# EAGLE design ac_meter_rev02 (EAGLE 5.11)
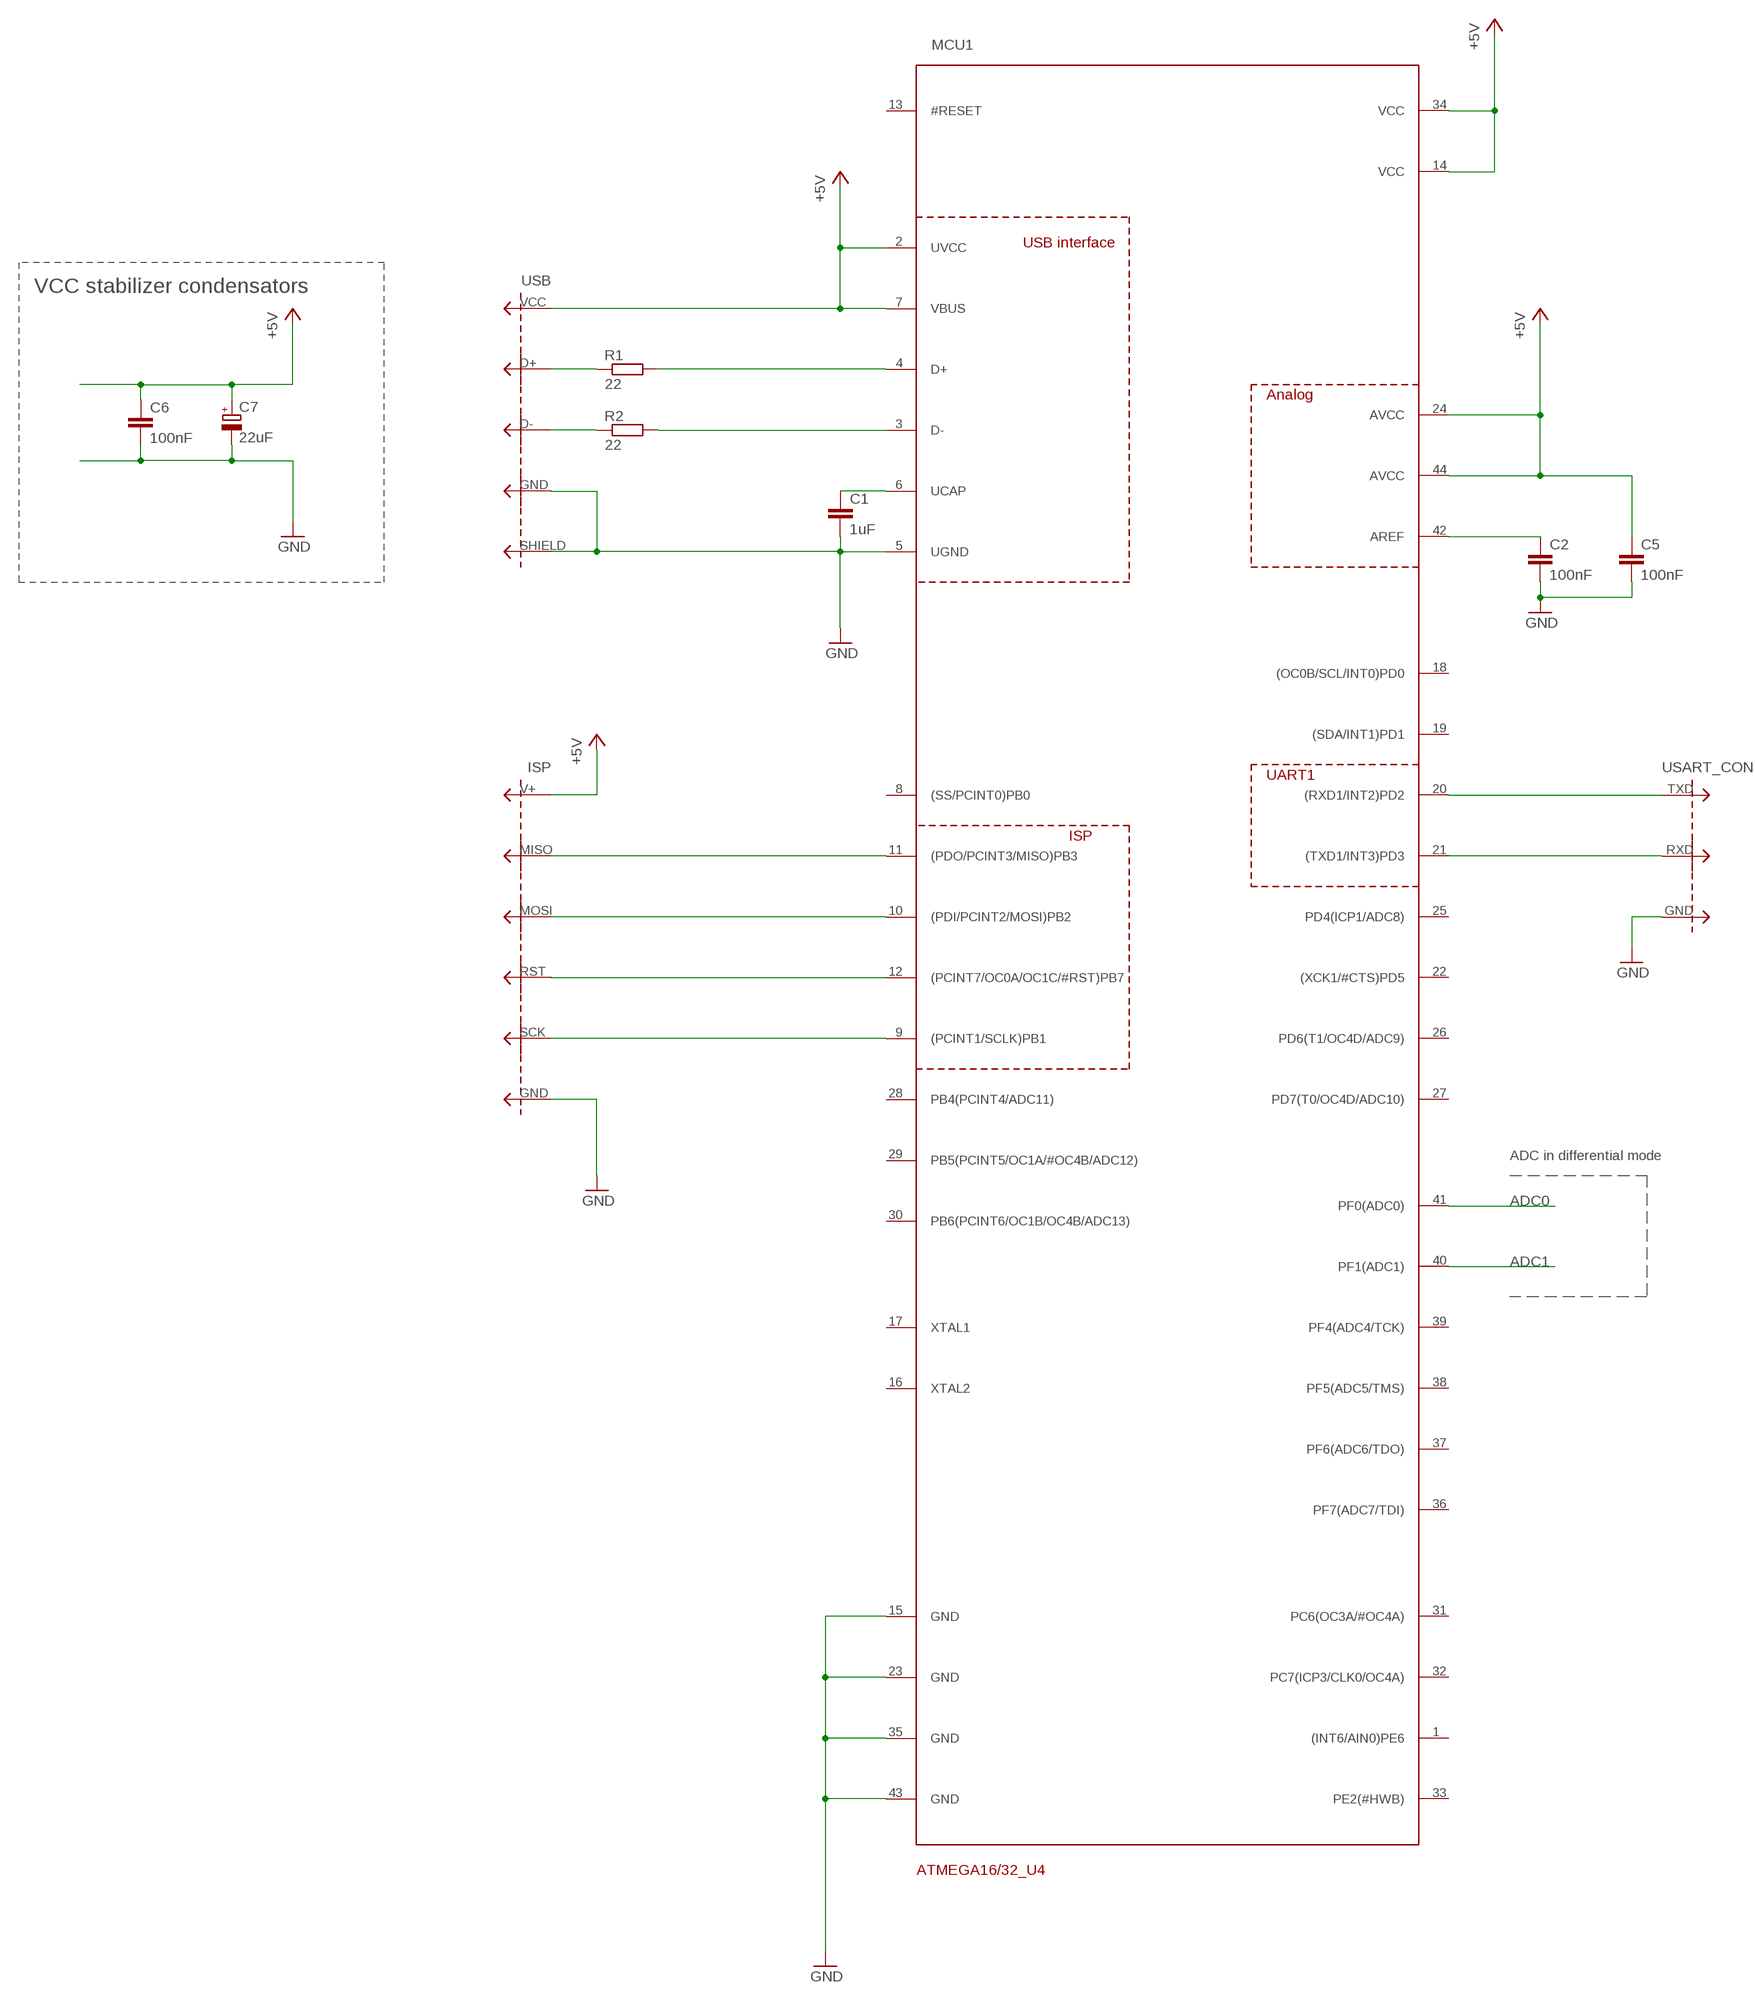
[diagram p0: schematic, sheet 1, part 1 of 2]
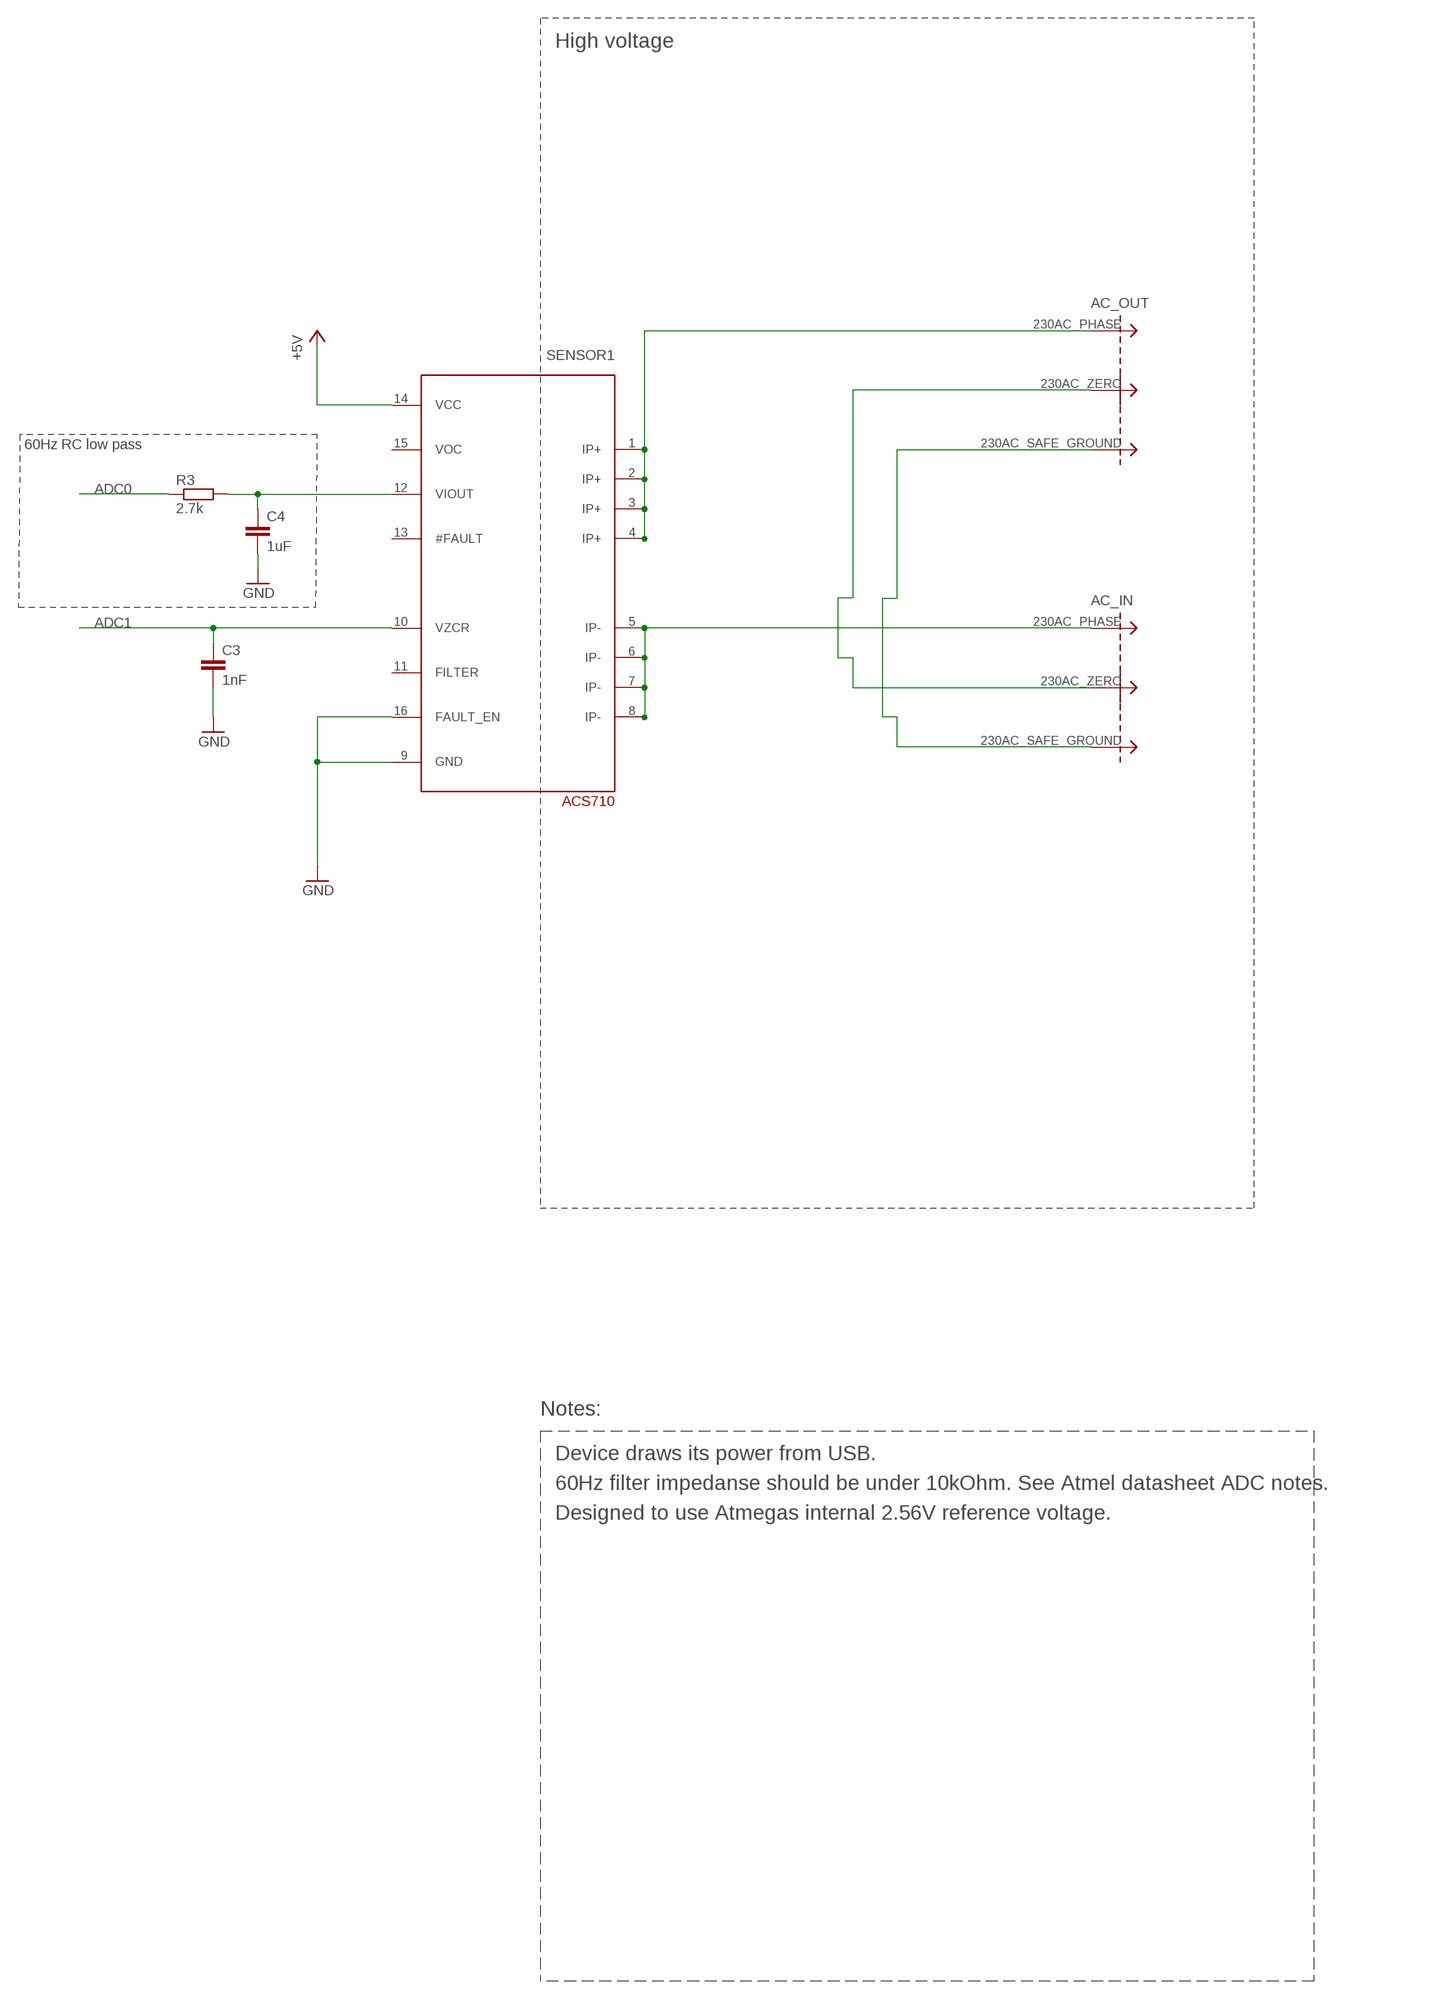
[diagram p1: schematic, sheet 1, part 2 of 2]

## Parts
AC_IN  CONNECTOR_3PINMAINS_SOLDER_PADS  [1X3_MAINS_SOLDER_PADS]
AC_OUT  CONNECTOR_3PINMAINS_SOLDER_PADS  [1X3_MAINS_SOLDER_PADS]
C1  1uF  C-EUC1206  [C1206]
C2  100nF  C-EUC1206  [C1206]
C3  1nF  C-EUC1206  [C1206]
C4  1uF  C-EUC1206  [C1206]
C5  100nF  C-EUC1206  [C1206]
C6  100nF  C-EUC1206  [C1206]
C7  22uF  CPOL-EUE2.5-6  [E2,5-6]
ISP  CONNECTOR_6PIN2X3_ISP  [2X3_ISP]
MCU1  ATMEGA16/32_U4  [TQFP44]
R1  22  R-EU_0207/10  [0207/10]
R2  22  R-EU_0207/10  [0207/10]
R3  2.7k  R-EU_0207/10  [0207/10]
SENSOR1  ACS710_CURRENT_SENSOR  [SO-16W]
USART_CON  CONNECTOR_3PINUSART  [1X3_USART]
USB  CONNECTOR_5PINUSB_SMD  [1X5_USB]

## Nets
+5V: C5.1 C6.1 C7.+ ISP.V+ MCU1.2(UVCC) MCU1.7(VBUS) MCU1.14(VCC) MCU1.24(AVCC) MCU1.34(VCC) MCU1.44(AVCC) SENSOR1.14(VCC) USB.VCC
ADC0: MCU1.41(PF0(ADC0)) R3.1
ADC1: C3.1 MCU1.40(PF1(ADC1)) SENSOR1.10(VZCR)
GND: C1.2 C2.2 C3.2 C4.2 C5.2 C6.2 C7.- ISP.GND MCU1.5(UGND) MCU1.15(GND) MCU1.23(GND) MCU1.35(GND) MCU1.43(GND) SENSOR1.9(GND) SENSOR1.16(FAULT_EN) USART_CON.GND USB.GND USB.SHIELD
N$1: ISP.MISO MCU1.11((PDO/PCINT3/MISO)PB3)
N$2: ISP.MOSI MCU1.10((PDI/PCINT2/MOSI)PB2)
N$3: ISP.RST MCU1.12((PCINT7/OC0A/OC1C/#RST)PB7)
N$4: ISP.SCK MCU1.9((PCINT1/SCLK)PB1)
N$5: R1.1 USB.D+
N$6: R2.1 USB.D-
N$7: MCU1.3(D-) R2.2
N$8: MCU1.4(D+) R1.2
N$9: C1.1 MCU1.6(UCAP)
N$10: C4.1 R3.2 SENSOR1.12(VIOUT)
N$11: C2.1 MCU1.42(AREF)
N$12: MCU1.20((RXD1/INT2)PD2) USART_CON.TXD
N$13: MCU1.21((TXD1/INT3)PD3) USART_CON.RXD
PHASE_IN: AC_IN.230AC_PHASE SENSOR1.5(IP-) SENSOR1.6(IP-) SENSOR1.7(IP-) SENSOR1.8(IP-)
PHASE_OUT: AC_OUT.230AC_PHASE SENSOR1.1(IP+) SENSOR1.2(IP+) SENSOR1.3(IP+) SENSOR1.4(IP+)
SAFE_GROUND: AC_IN.230AC_SAFE_GROUND AC_OUT.230AC_SAFE_GROUND
ZERO: AC_IN.230AC_ZERO AC_OUT.230AC_ZERO
Unconnected: MCU1.1((INT6/AIN0)PE6) MCU1.8((SS/PCINT0)PB0) MCU1.13(#RESET) MCU1.16(XTAL2) MCU1.17(XTAL1) MCU1.18((OC0B/SCL/INT0)PD0) MCU1.19((SDA/INT1)PD1) MCU1.22((XCK1/#CTS)PD5) MCU1.25(PD4(ICP1/ADC8)) MCU1.26(PD6(T1/OC4D/ADC9)) MCU1.27(PD7(T0/OC4D/ADC10)) MCU1.28(PB4(PCINT4/ADC11)) MCU1.29(PB5(PCINT5/OC1A/#OC4B/ADC12)) MCU1.30(PB6(PCINT6/OC1B/OC4B/ADC13)) MCU1.31(PC6(OC3A/#OC4A)) MCU1.32(PC7(ICP3/CLK0/OC4A)) MCU1.33(PE2(#HWB)) MCU1.36(PF7(ADC7/TDI)) MCU1.37(PF6(ADC6/TDO)) MCU1.38(PF5(ADC5/TMS)) MCU1.39(PF4(ADC4/TCK)) SENSOR1.11(FILTER) SENSOR1.13(#FAULT) SENSOR1.15(VOC)

## Notes on the sheet
- High voltage
- 60Hz RC low pass
- VCC stabilizer condensators
- Notes:
- ADC in differential mode
- Device draws its power from USB.
- 60Hz filter impedanse should be under 10kOhm. See Atmel datasheet ADC notes.
- Designed to use Atmegas internal 2.56V reference voltage.

## Library data of the parts
AC_IN AC_OUT USART_CON = connectors:CONNECTOR_3PIN
C1-C6 = RC_and_L:C-EU: CAPACITOR, European symbol
C7 = RC_and_L:CPOL-EU: POLARIZED CAPACITOR, European symbol
ISP = connectors:CONNECTOR_6PIN
MCU1 = project_specific_parts:ATMEGA16/32_U4
R1-R3 = RC_and_L:R-EU_: RESISTOR, European symbol
SENSOR1 = project_specific_parts:ACS710_CURRENT_SENSOR
USB = connectors:CONNECTOR_5PIN

## Board
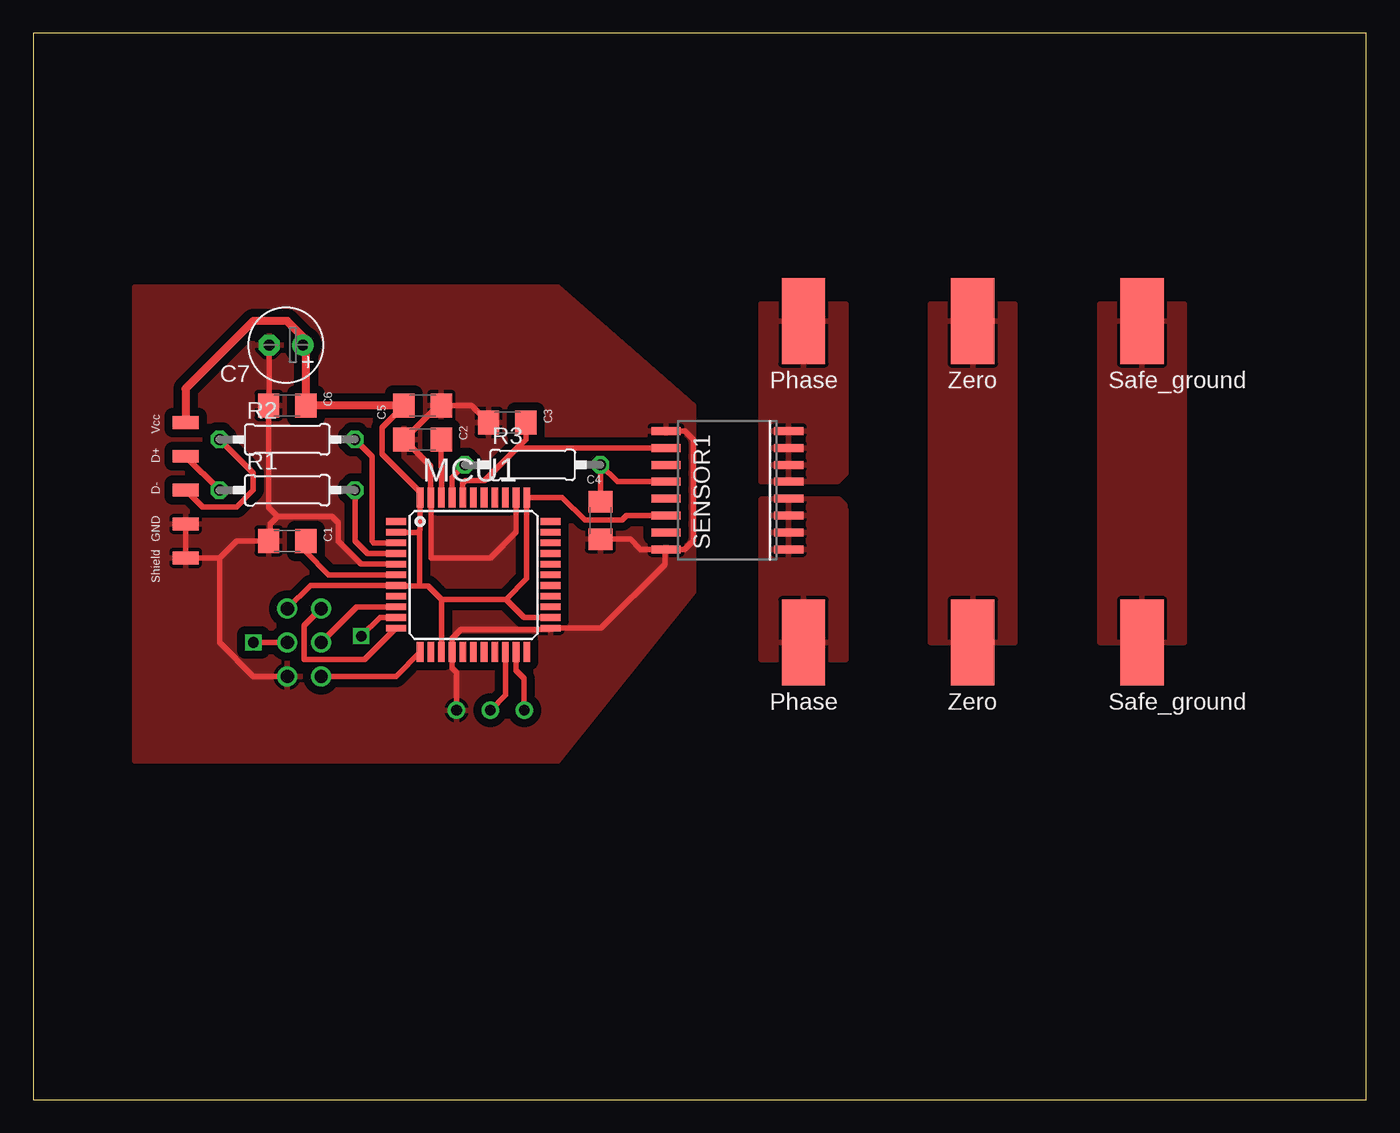
[diagram p2: board, top side]
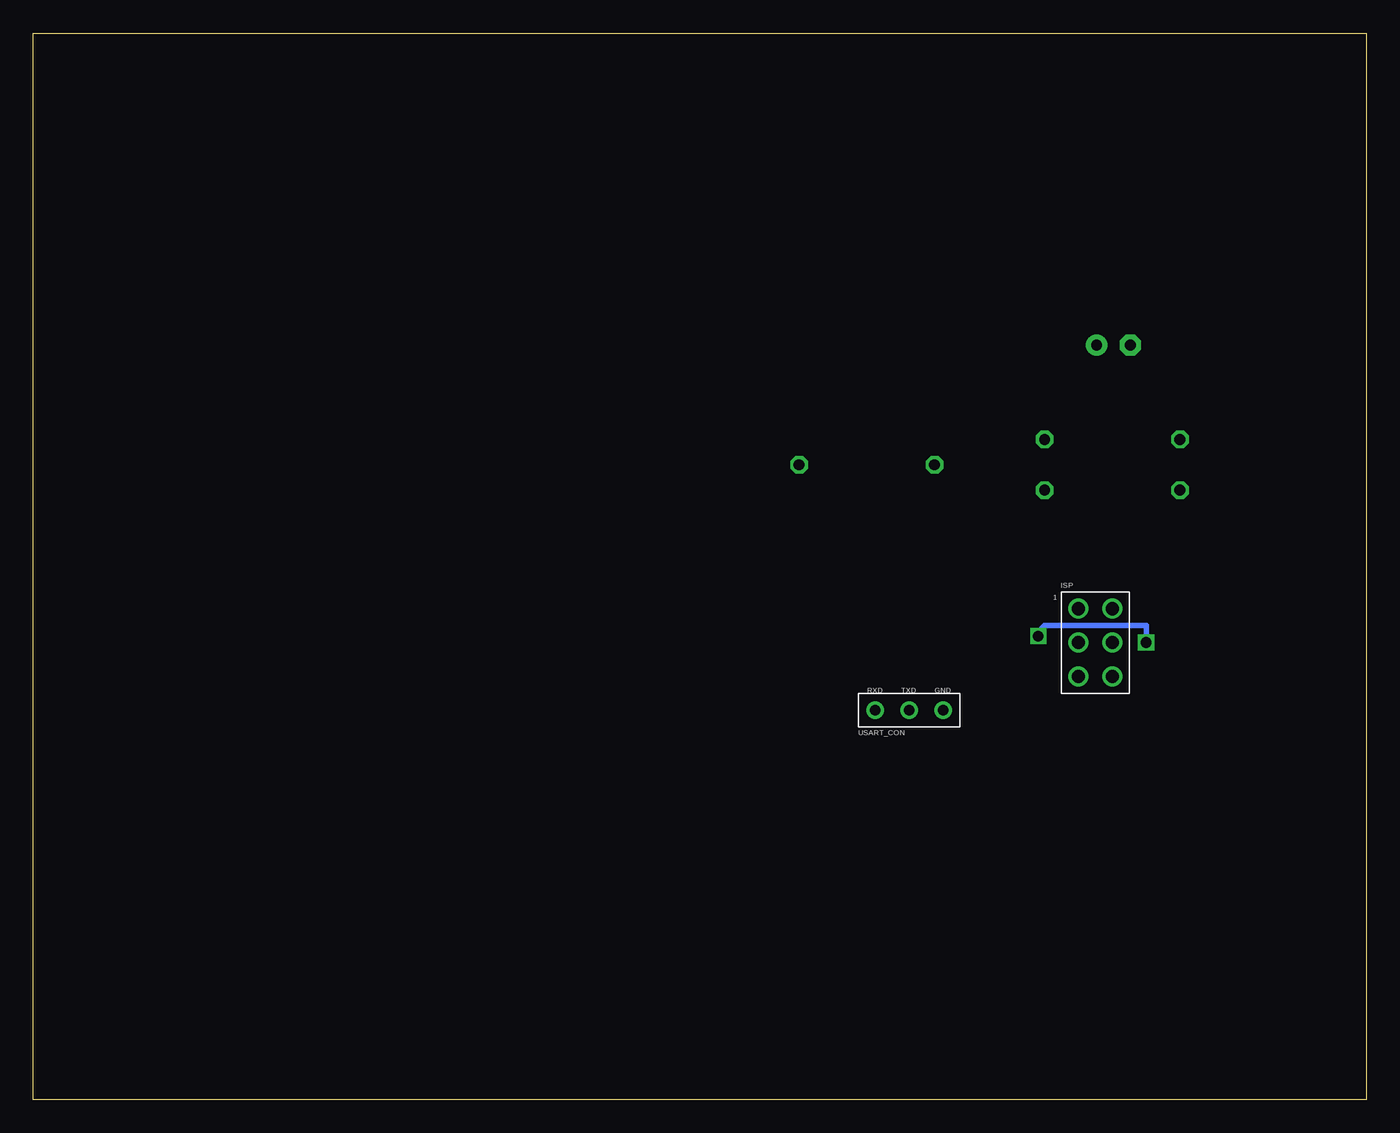
[diagram p3: board, bottom side, seen from below]

Size 100 x 80 mm. Coordinates in mm from the lower left corner, seen from the top.
Outline: 0,0 100,0 100,80 0,80 0,0
Copper layers (1*16): Top 0.035mm / dielectric 1.5mm / Bottom 0.035mm
Design rules "default *": minimum track width 10mil, minimum drill 24mil, track to track 24mil, track to pad 24mil, pad to pad 8mil, via to via 8mil, smd to smd 8mil, copper to edge 40mil, drill to drill 8mil, minimum pad ring 10mil, minimum via ring 8mil, stop-mask expansion 4mil, vias tented up to drill 0mil, thermal gap 10mil

### Footprints (pad centres in the part's own frame; a part is rotated, then mirrored left to right if it is on the bottom)
1X3_MAINS_SOLDER_PADS = smd 3.251 x 6.452: 230AC_PHASE -12.7,0; 230AC_SAFE_GROUND 12.7,0; 230AC_ZERO 0,0
C1206 = smd 1.6 x 1.8: 1 -1.4,0; 2 1.4,0
E2,5-6 = drill 0.813 pad 1.6 round: + -1.27,0 | drill 0.813 pad 1.6 octagon: - 1.27,0
2X3_ISP = drill 1 round: GND 1.27,-5.08; MISO -1.27,0; MOSI 1.27,-2.54; RST -1.27,-5.08; SCK -1.27,-2.54; V+ 1.27,0
TQFP44 = smd 1.5 x 0.5: 1 -5.8,4; 2 -5.8,3.2; 3 -5.8,2.4; 4 -5.8,1.6; 5 -5.8,0.8; 6 -5.8,0; 7 -5.8,-0.8; 8 -5.8,-1.6; 9 -5.8,-2.4; 10 -5.8,-3.2; 11 -5.8,-4; 23 5.8,-4; 24 5.8,-3.2; 25 5.8,-2.4; 26 5.8,-1.6; 27 5.8,-0.8; 28 5.8,0; 29 5.8,0.8; 30 5.8,1.6; 31 5.8,2.4; 32 5.8,3.2; 33 5.8,4 | smd 0.5 x 1.5: 12 -4,-5.8; 13 -3.2,-5.8; 14 -2.4,-5.8; 15 -1.6,-5.8; 16 -0.8,-5.8; 17 0,-5.8; 18 0.8,-5.8; 19 1.6,-5.8; 20 2.4,-5.8; 21 3.2,-5.8; 22 4,-5.8; 34 4,5.8; 35 3.2,5.8; 36 2.4,5.8; 37 1.6,5.8; 38 0.8,5.8; 39 0,5.8; 40 -0.8,5.8; 41 -1.6,5.8; 42 -2.4,5.8; 43 -3.2,5.8; 44 -4,5.8
0207/10 = drill 0.813 octagon: 1 -5.08,0; 2 5.08,0
SO-16W = smd 0.6 x 2.2: 1 -4.445,-4.6; 2 -3.175,-4.6; 3 -1.905,-4.6; 4 -0.635,-4.6; 5 0.635,-4.6; 6 1.905,-4.6; 7 3.175,-4.6; 8 4.445,-4.6; 9 4.445,4.6; 10 3.175,4.6; 11 1.905,4.6; 12 0.635,4.6; 13 -0.635,4.6; 14 -1.905,4.6; 15 -3.175,4.6; 16 -4.445,4.6
1X3_USART = drill 0.8 round: GND 2.54,0; RXD -2.54,0; TXD 0,0
1X5_USB = smd 0.965 x 1.93: D+ 0,0; D- 2.54,0; GND 5.08,0; SHIELD 7.62,0; VCC -2.54,0

### Placement (x,y rotation side)
AC_IN  70.48,58.42 0 top
AC_OUT  70.48,34.29 0 top
C1  19.05,41.91 180 top
C2  29.21,49.53 180 top
C3  35.56,50.8 180 top
C4  42.55,43.45 270 top
C5  29.21,52.07 0 top
C6  19.05,52.07 180 top
C7  18.96,56.61 180 top
ISP  20.32,36.83 0 bottom
MCU1  33.02,39.37 0 top
R1  19.05,45.72 0 top
R2  19.05,49.53 0 top
R3  37.47,47.62 0 top
SENSOR1  52.07,45.72 90 top
USART_CON  34.29,29.21 0 bottom
USB  11.43,48.26 270 top

### Tracks (layer width: path | path; a pad name or v marks a point on that pad's centre or on a via)
+5V
  Top 0.406: 30.62,37.53 MCU1.14 | 30.62,37.53 29.62,38.53 28.97,38.53 | 28.97,38.53 27.26,38.53 MCU1.7 20.79,38.57 ISP.V+ | 28.82,42.56 29.02,42.76 MCU1.44 29.02,45.59 26.17,48.44 26.17,50.43 C5.1 | 28.82,42.56 27.23,42.56 MCU1.2 | 30.62,37.53 35.47,37.53 | 35.47,37.53 36.83,36.16 MCU1.24 | 35.47,37.53 37.02,39.08 MCU1.34 39.68,45.17 41.38,43.47 44.17,43.47 44.52,43.81 SENSOR1.14 | 20.45,56.38 C7.+ 20.32,56.7 20.32,57.15 | 28.82,42.56 28.97,42.56 28.97,38.53
  Top 0.61: C5.1 C6.1 20.45,56.38 | USB.VCC 11.43,53.34 16.51,58.42 19.05,58.42 20.32,57.15
ADC0
  Top 0.406: MCU1.41 31.42,46.66 R3.1
ADC1
  Top 0.406: C3.1 36.96,49.54 36.42,49 | 36.42,49 33.87,46.44 32.44,46.44 32.22,46.22 MCU1.40 | SENSOR1.10 36.52,48.9 36.42,49
GND
  Top 0.406: MCU1.15 | 13.97,40.64 15.24,41.91 C1.2 17.77,42.03 17.77,43.17 18.34,43.74 | 13.97,40.64 USB.SHIELD USB.GND | 13.97,40.64 13.97,34.29 16.51,31.75 ISP.GND | MCU1.5 24.6,40.17 22.86,41.91 22.86,43.3 22.42,43.74 18.34,43.74 | USART_CON.GND 31.75,32.03 31.44,32.34 31.44,32.36 31.43,32.37 MCU1.15 | MCU1.15 31.43,34.61 32.08,35.26 38.71,35.26 MCU1.23 42.59,35.37 47.38,40.15 47.38,41.18 SENSOR1.16 | MCU1.35 36.22,42.57 34.29,40.64 29.84,40.64 29.84,45.15 MCU1.43 29.82,47.52 C2.2 30.35,52.07 C5.2 32.89,52.07 C3.2 | C4.2 44.79,42.05 45.57,41.27 SENSOR1.16 | SENSOR1.9 48.9,50.16 49.53,49.53 49.53,41.93 48.87,41.27 SENSOR1.16 | C7.- 17.69,52.11 C6.2 17.65,44.43 18.34,43.74
  pour Top: 7.62,60.96 7.62,25.4 39.37,25.4 49.53,38.1 49.53,52.07 39.37,60.96
N$1
  Top 0.406: ISP.MISO 20.32,35.56 20.32,33.02 24.87,33.02 MCU1.11
N$2  (via drill 0.8)
  Top 0.406: MCU1.10 26.01,36.17 v24.61,34.77 | v16.51,34.29 ISP.MOSI
  Bottom 0.406: v24.61,34.77 24.61,35.08 24.13,35.56 16.51,35.56 v16.51,34.29
N$3
  Top 0.406: ISP.RST 27.2,31.75 MCU1.12
N$4
  Top 0.406: MCU1.9 24.27,36.97 ISP.SCK
N$5
  Top 0.406: USB.D+ R1.1
N$6
  Top 0.406: USB.D- 12.7,44.45 15.24,44.45 16.51,45.72 16.51,46.99 R2.1
N$7
  Top 0.406: MCU1.3 25.54,41.77 25.4,41.91 25.4,48.26 R2.2
N$8
  Top 0.406: MCU1.4 25.07,40.97 24.13,41.91 R1.2
N$9
  Top 0.406: C1.1 20.45,41.08 22.16,39.37 MCU1.6
N$10
  Top 0.406: SENSOR1.12 43.81,46.35 R3.2 C4.1
N$11
  Top 0.406: MCU1.42 30.62,47.5 30.61,47.51 C2.1
N$12
  Top 0.406: MCU1.20 35.42,30.34 USART_CON.TXD
N$13
  Top 0.406: USART_CON.RXD 36.83,31.59 36.23,32.2 MCU1.21
PHASE_IN
  pour Top: 57.15,59.69 54.61,59.69 54.61,46.4 54.59,46.38 60.35,46.38 60.96,46.99 60.96,59.69
PHASE_OUT
  pour Top: 58.42,33.02 60.96,33.02 60.96,44.23 60.91,44.28 60.91,44.58 60.42,45.07 54.66,45.07 54.61,45.02 54.61,33.02 54.61,33.02
SAFE_GROUND
  pour Top: 82.55,59.69 80.01,59.69 80.01,34.29 86.36,34.29 86.36,59.69
ZERO
  pour Top: 73.66,59.69 73.66,34.29 67.31,34.29 67.31,59.69